# EAGLE design WS2811Verstärker (EAGLE 7.0.0)
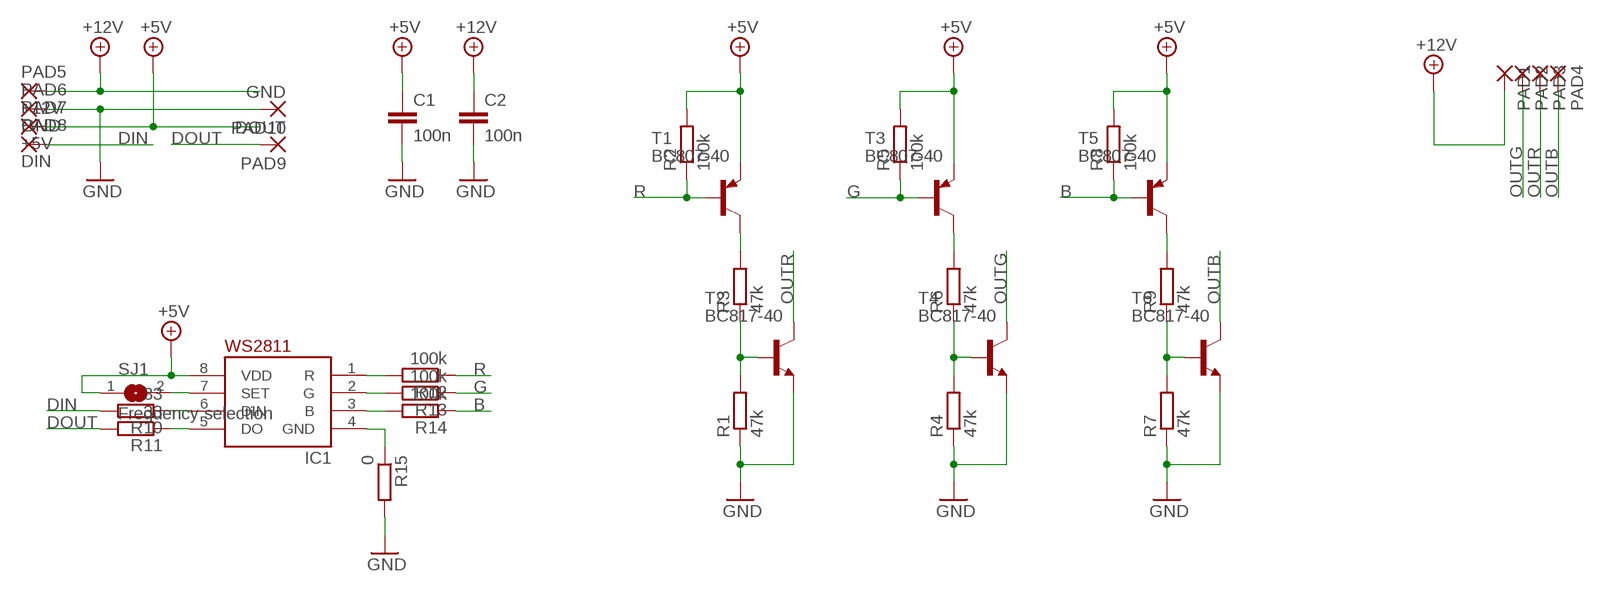
[diagram p0: schematic, sheet 1]

## Parts
C1  100n  C-EUC1206  [C1206]
C2  100n  C-EUC1206  [C1206]
IC1  WS2811-SOP8  [SO08-SKINNYPADS]
PAD1  SMD5  [SMD2,54-5,08]
PAD2  SMD5  [SMD2,54-5,08]
PAD3  SMD5  [SMD2,54-5,08]
PAD4  SMD5  [SMD2,54-5,08]
PAD5  +12V  SMD5  [SMD2,54-5,08]
PAD6  GND  SMD5  [SMD2,54-5,08]
PAD7  +5V  SMD5  [SMD2,54-5,08]
PAD8  DIN  SMD5  [SMD2,54-5,08]
PAD9  DOUT  SMD5  [SMD2,54-5,08]
PAD10  GND  SMD5  [SMD2,54-5,08]
R1  47k  R-EU_R1206  [R1206]
R2  100k  R-EU_R1206  [R1206]
R3  47k  R-EU_R1206  [R1206]
R4  47k  R-EU_R1206  [R1206]
R5  100k  R-EU_R1206  [R1206]
R6  47k  R-EU_R1206  [R1206]
R7  47k  R-EU_R1206  [R1206]
R8  100k  R-EU_R1206  [R1206]
R9  47k  R-EU_R1206  [R1206]
R10  33  R-EU_R1206  [R1206]
R11  33  R-EU_R1206  [R1206]
R12  100k  R-EU_R1206  [R1206]
R13  100k  R-EU_R1206  [R1206]
R14  100k  R-EU_R1206  [R1206]
R15  0  R-EU_R1206  [R1206]
SJ1  Frequency selection  SJ  [SJ]
T1  BC807-40  BC807-40-PNP-SOT23-BEC  [SOT23-BEC]
T2  BC817-40  BC817-40-NPN-SOT23-BEC  [SOT23-BEC]
T3  BC807-40  BC807-40-PNP-SOT23-BEC  [SOT23-BEC]
T4  BC817-40  BC817-40-NPN-SOT23-BEC  [SOT23-BEC]
T5  BC807-40  BC807-40-PNP-SOT23-BEC  [SOT23-BEC]
T6  BC817-40  BC817-40-NPN-SOT23-BEC  [SOT23-BEC]

## Nets
+5V: C1.1 IC1.8(VDD) PAD7.1(P) R2.2 R5.2 R8.2 SJ1.1 T1.E T3.E T5.E
+12V: C2.1 PAD1.1(P) PAD5.1(P)
B: R8.1 R14.1 T5.B
DIN: PAD8.1(P) R10.2
DOUT: PAD9.1(P) R11.2
G: R5.1 R13.1 T3.B
GND: C1.2 C2.2 PAD6.1(P) PAD10.1(P) R1.1 R4.1 R7.1 R15.2 T2.E T4.E T6.E
N$1: R1.2 R3.1 T2.B
N$2: R3.2 T1.C
N$3: IC1.7(SET) SJ1.2
N$4: R4.2 R6.1 T4.B
N$5: R6.2 T3.C
N$6: IC1.6(DIN) R10.1
N$7: R7.2 R9.1 T6.B
N$8: R9.2 T5.C
N$9: IC1.5(DO) R11.1
N$10: IC1.1(R) R12.2
N$11: IC1.2(G) R13.2
N$12: IC1.3(B) R14.2
N$17: IC1.4(GND) R15.1
OUTB: PAD4.1(P) T6.C
OUTG: PAD2.1(P) T4.C
OUTR: PAD3.1(P) T2.C
R: R2.1 R12.1 T1.B

## Library data of the parts
C1 C2 = rcl:C-EU: CAPACITOR, European symbol
IC1 = adafruit:WS2811
PAD1-PAD10 = wirepad:SMD5: SMD PAD
R1-R15 = rcl:R-EU_: RESISTOR, European symbol
SJ1 = jumper:SJ: SMD solder JUMPER
T1 T3 T5 = transistor:*-PNP-: PNP Transistror
T2 T4 T6 = transistor:*-NPN-: NPN Transistror BF959 corrected 2008.03.06

## Board
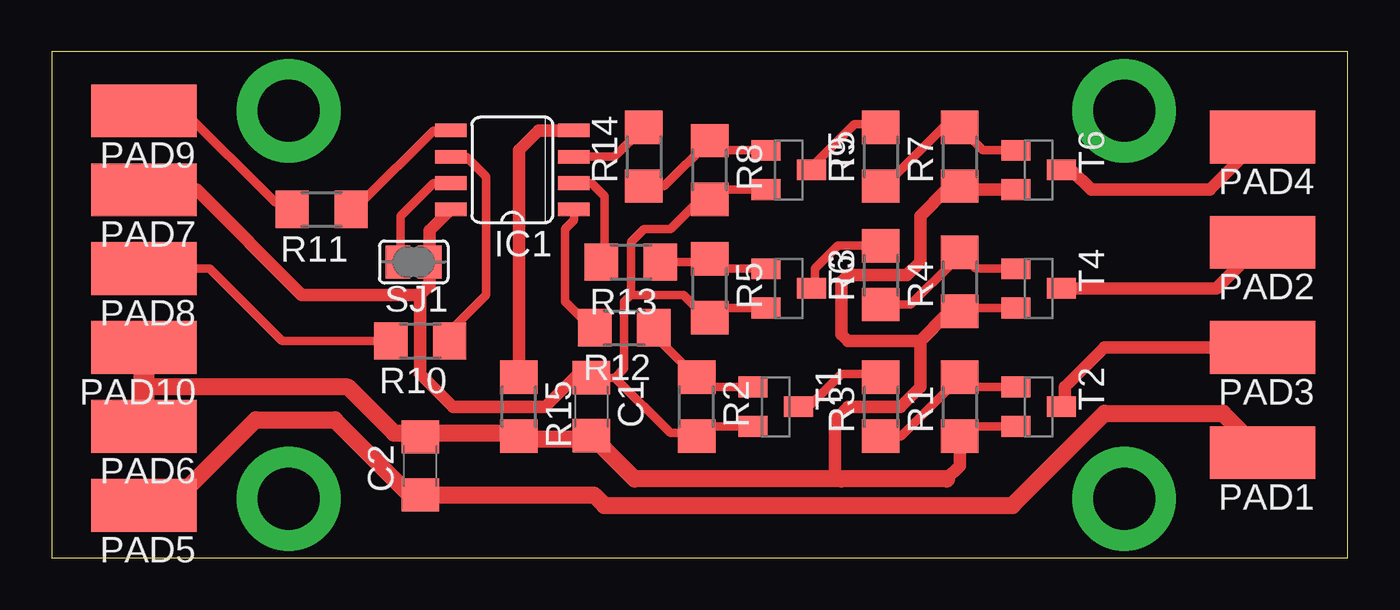
[diagram p1: board, top side]

Size 62.53 x 24.44 mm. Coordinates in mm from the lower left corner, seen from the top.
Outline: 0,0 62.53,0 62.53,24.44 0,24.44 0,0
Copper layers (1*16): Top 0.035mm / dielectric 1.5mm / Bottom 0.035mm
Design rules "default *": minimum track width 10mil, minimum drill 24mil, track to track 8mil, track to pad 8mil, pad to pad 8mil, via to via 8mil, smd to smd 8mil, copper to edge 40mil, drill to drill 8mil, minimum pad ring 20mil, minimum via ring 20mil, stop-mask expansion 4mil, vias tented up to drill 0mil, thermal gap 10mil

### Footprints (pad centres in the part's own frame; a part is rotated, then mirrored left to right if it is on the bottom)
C1206 = smd 1.6 x 1.8: 1 -1.4,0; 2 1.4,0
SO08-SKINNYPADS = smd 0.66 x 1.524: 1 -1.905,-2.973; 2 -0.635,-2.973; 3 0.635,-2.973; 4 1.905,-2.973; 5 1.905,2.973; 6 0.635,2.973; 7 -0.635,2.973; 8 -1.905,2.973
SMD2,54-5,08 = smd 2.54 x 5.08: 1 0,0
R1206 = smd 1.6 x 1.803: 1 -1.422,0; 2 1.422,0
SJ = smd 1.168 x 1.6: 1 -0.762,0; 2 0.762,0
SOT23-BEC = smd 1 x 1.4: B -0.95,-1.1; C 0,1.1; E 0.95,-1.1

### Placement (x,y rotation side)
C1  26.04,7.3 270 top
C2  17.78,4.45 90 top
IC1  22.23,18.73 90 top
PAD1  58.42,5.08 90 top
PAD2  58.42,15.24 90 top
PAD3  58.42,10.16 90 top
PAD4  58.42,20.32 90 top
PAD5  4.45,2.54 90 top
PAD6  4.45,6.35 90 top
PAD7  4.45,17.78 90 top
PAD8  4.45,13.97 90 top
PAD9  4.45,21.59 90 top
PAD10  4.45,10.16 90 top
R1  43.81,7.3 90 top
R2  31.11,7.3 270 top
R3  40.01,7.3 90 top
R4  43.81,13.34 90 top
R5  31.75,13.02 270 top
R6  40.01,13.65 90 top
R7  43.81,19.37 90 top
R8  31.75,18.73 270 top
R9  40.01,19.37 90 top
R10  17.78,10.48 180 top
R11  13.02,16.83 180 top
R12  27.62,11.11 180 top
R13  27.94,14.29 180 top
R14  28.57,19.37 90 top
R15  22.54,7.3 270 top
SJ1  17.46,14.29 180 top
T1  34.92,7.3 270 top
T2  47.62,7.3 270 top
T3  35.56,13.02 270 top
T4  47.62,13.02 270 top
T5  35.56,18.73 270 top
T6  47.62,18.73 270 top

### Tracks (layer width: path | path; a pad name or v marks a point on that pad's centre or on a via)
+5V
  Top 0.406: T3.E 32.22,12.07 R5.2 31.58,11.6 30.48,12.7 27.94,12.7 | T1.E 31.59,6.35 R2.2 30.96,6.03 29.84,6.03 27.18,8.7 | 19.18,16.75 IC1.8 | C1.1 27.18,8.7 | 27.94,12.7 27.94,15.24 28.57,15.88 29.84,15.88 31.28,17.31 R8.2 32.22,17.78 T5.E | 27.18,8.7 27.62,9.15 27.62,12.38 27.94,12.7
  Top 0.61: IC1.8 18.22,15.8 SJ1.1 18.22,13.14 17.78,12.7 | PAD7.1 6.99,17.78 12.06,12.7 17.78,12.7 | 17.78,12.7 17.78,8.89 19.37,7.3 23.81,7.3 25.4,8.89 25.85,8.89 C1.1
+12V
  Top 0.813: PAD5.1 5.71,2.54 9.84,6.67 13.65,6.67 17.14,3.17 17.65,3.17 C2.1 26.16,3.04 26.67,2.54 46.35,2.54 50.8,6.99 56.52,6.99 PAD1.1
B
  Top 0.406: R14.1 29.54,17.95 R8.1 32.22,19.68 T5.B
DIN
  Top 0.406: 16.19,10.48 R10.2 11.11,10.48 7.62,13.97 PAD8.1
DOUT
  Top 0.406: PAD9.1 6.35,21.59 10.79,17.14 R11.2
G
  Top 0.406: R13.1 31.6,14.29 R5.1 32.22,13.97 T3.B
GND
  Top 0.406: R4.1 44.29,12.07 T4.E | 44.29,17.78 R7.1 | T2.E 44.29,6.35 R1.1
  Top 0.61: C1.2 25.85,5.71 25.72,5.71 25.91,5.9 C1.2 | 43.81,5.71 R1.1 | R7.1 43.98,17.78 T6.E 43.18,17.78 41.91,16.51 41.91,14.29 41.27,13.65 38.42,13.65 38.1,13.34 38.1,10.79 38.42,10.48 41.91,10.48 | 41.91,10.48 41.91,8.26 40.96,7.3 38.42,7.3 37.78,6.67 37.78,4.13 38.1,3.81 | 43.66,11.91 R4.1 43.65,11.75 43.18,11.75 41.91,10.48 | 5.08,10.16 PAD10.1 | 22.38,5.71 R15.2 | 26.01,5.88 C1.2 | 44.29,6.35 44.29,6.19 43.81,5.71 | 43.81,5.71 43.81,4.45 43.18,3.81 | C2.2 17.78,6.03
  Top 0.813: 4.45,8.57 4.76,8.26 14.29,8.26 16.51,6.03 17.78,6.03 22.39,6.03 R15.2 22.71,5.71 25.72,5.71 | 43.18,3.81 38.1,3.81 28.13,3.81 C1.2
  Top 1.016: PAD10.1 4.45,8.57 PAD6.1
N$1
  Top 0.406: R3.1 40.97,5.88 R1.2 44.29,8.25 T2.B
N$2
  Top 0.406: T1.C 36.51,7.3 38.1,8.89 39.84,8.89 R3.2
N$3
  Top 0.406: IC1.7 18.41,18.1 16.83,16.51 16.83,14.41 SJ1.2
N$4
  Top 0.406: T4.B 44.6,13.97 R4.2 43.5,14.44 43.5,14.29 41.44,12.23 R6.1
N$5
  Top 0.406: R6.2 37.93,15.07 36.83,13.97 36.83,13.19 T3.C
N$6
  Top 0.406: IC1.6 20,19.37 20.95,18.41 20.95,12.7 19.05,10.79 19.05,10.63 R10.1
N$7
  Top 0.406: T6.B 44.92,19.68 R7.2 43.01,20.79 40.64,18.41 40.47,18.41 R9.1
N$8
  Top 0.406: T5.C 36.66,18.88 38.73,20.95 39.84,20.95 R9.2
N$9
  Top 0.406: R11.1 14.92,17.14 18.41,20.64 IC1.5
N$10
  Top 0.406: IC1.1 25.2,16.31 24.77,15.88 24.77,12.38 25.72,11.43 26.2,11.43 R12.2
N$11
  Top 0.406: IC1.2 26.04,18.1 26.67,17.46 26.67,14.44 R13.2
N$12
  Top 0.406: IC1.3 27.15,19.37 R14.2
N$13  (via drill 3 pad 5)
  other vias: 11.43,2.86
N$14  (via drill 3 pad 5)
  other vias: 51.75,21.59
N$15  (via drill 3 pad 5)
  other vias: 51.75,2.86
N$16  (via drill 3 pad 5)
  other vias: 11.43,21.59
N$17
  Top 0.61: R15.1 22.54,19.68 23.5,20.64 IC1.4
OUTB
  Top 0.61: T6.C 49.21,18.73 50.16,17.78 55.88,17.78 PAD4.1
OUTG
  Top 0.61: T4.C 56.2,13.02 PAD2.1
OUTR
  Top 0.61: PAD3.1 50.8,10.16 48.9,8.26 48.9,7.47 T2.C
R
  Top 0.406: R12.1 29.04,10.79 R2.1 31.59,8.25 T1.B